# Altium schematic sheet WL-DAC.SchDoc
size 420 x 297 mm; Scale: 1:1; DocumentType: Схема электрическая принципиальная; FirstReferrence: UA3REO/R7KBI; DocumentNumber: 5; SheetNumber: 5; SheetTotal: 12
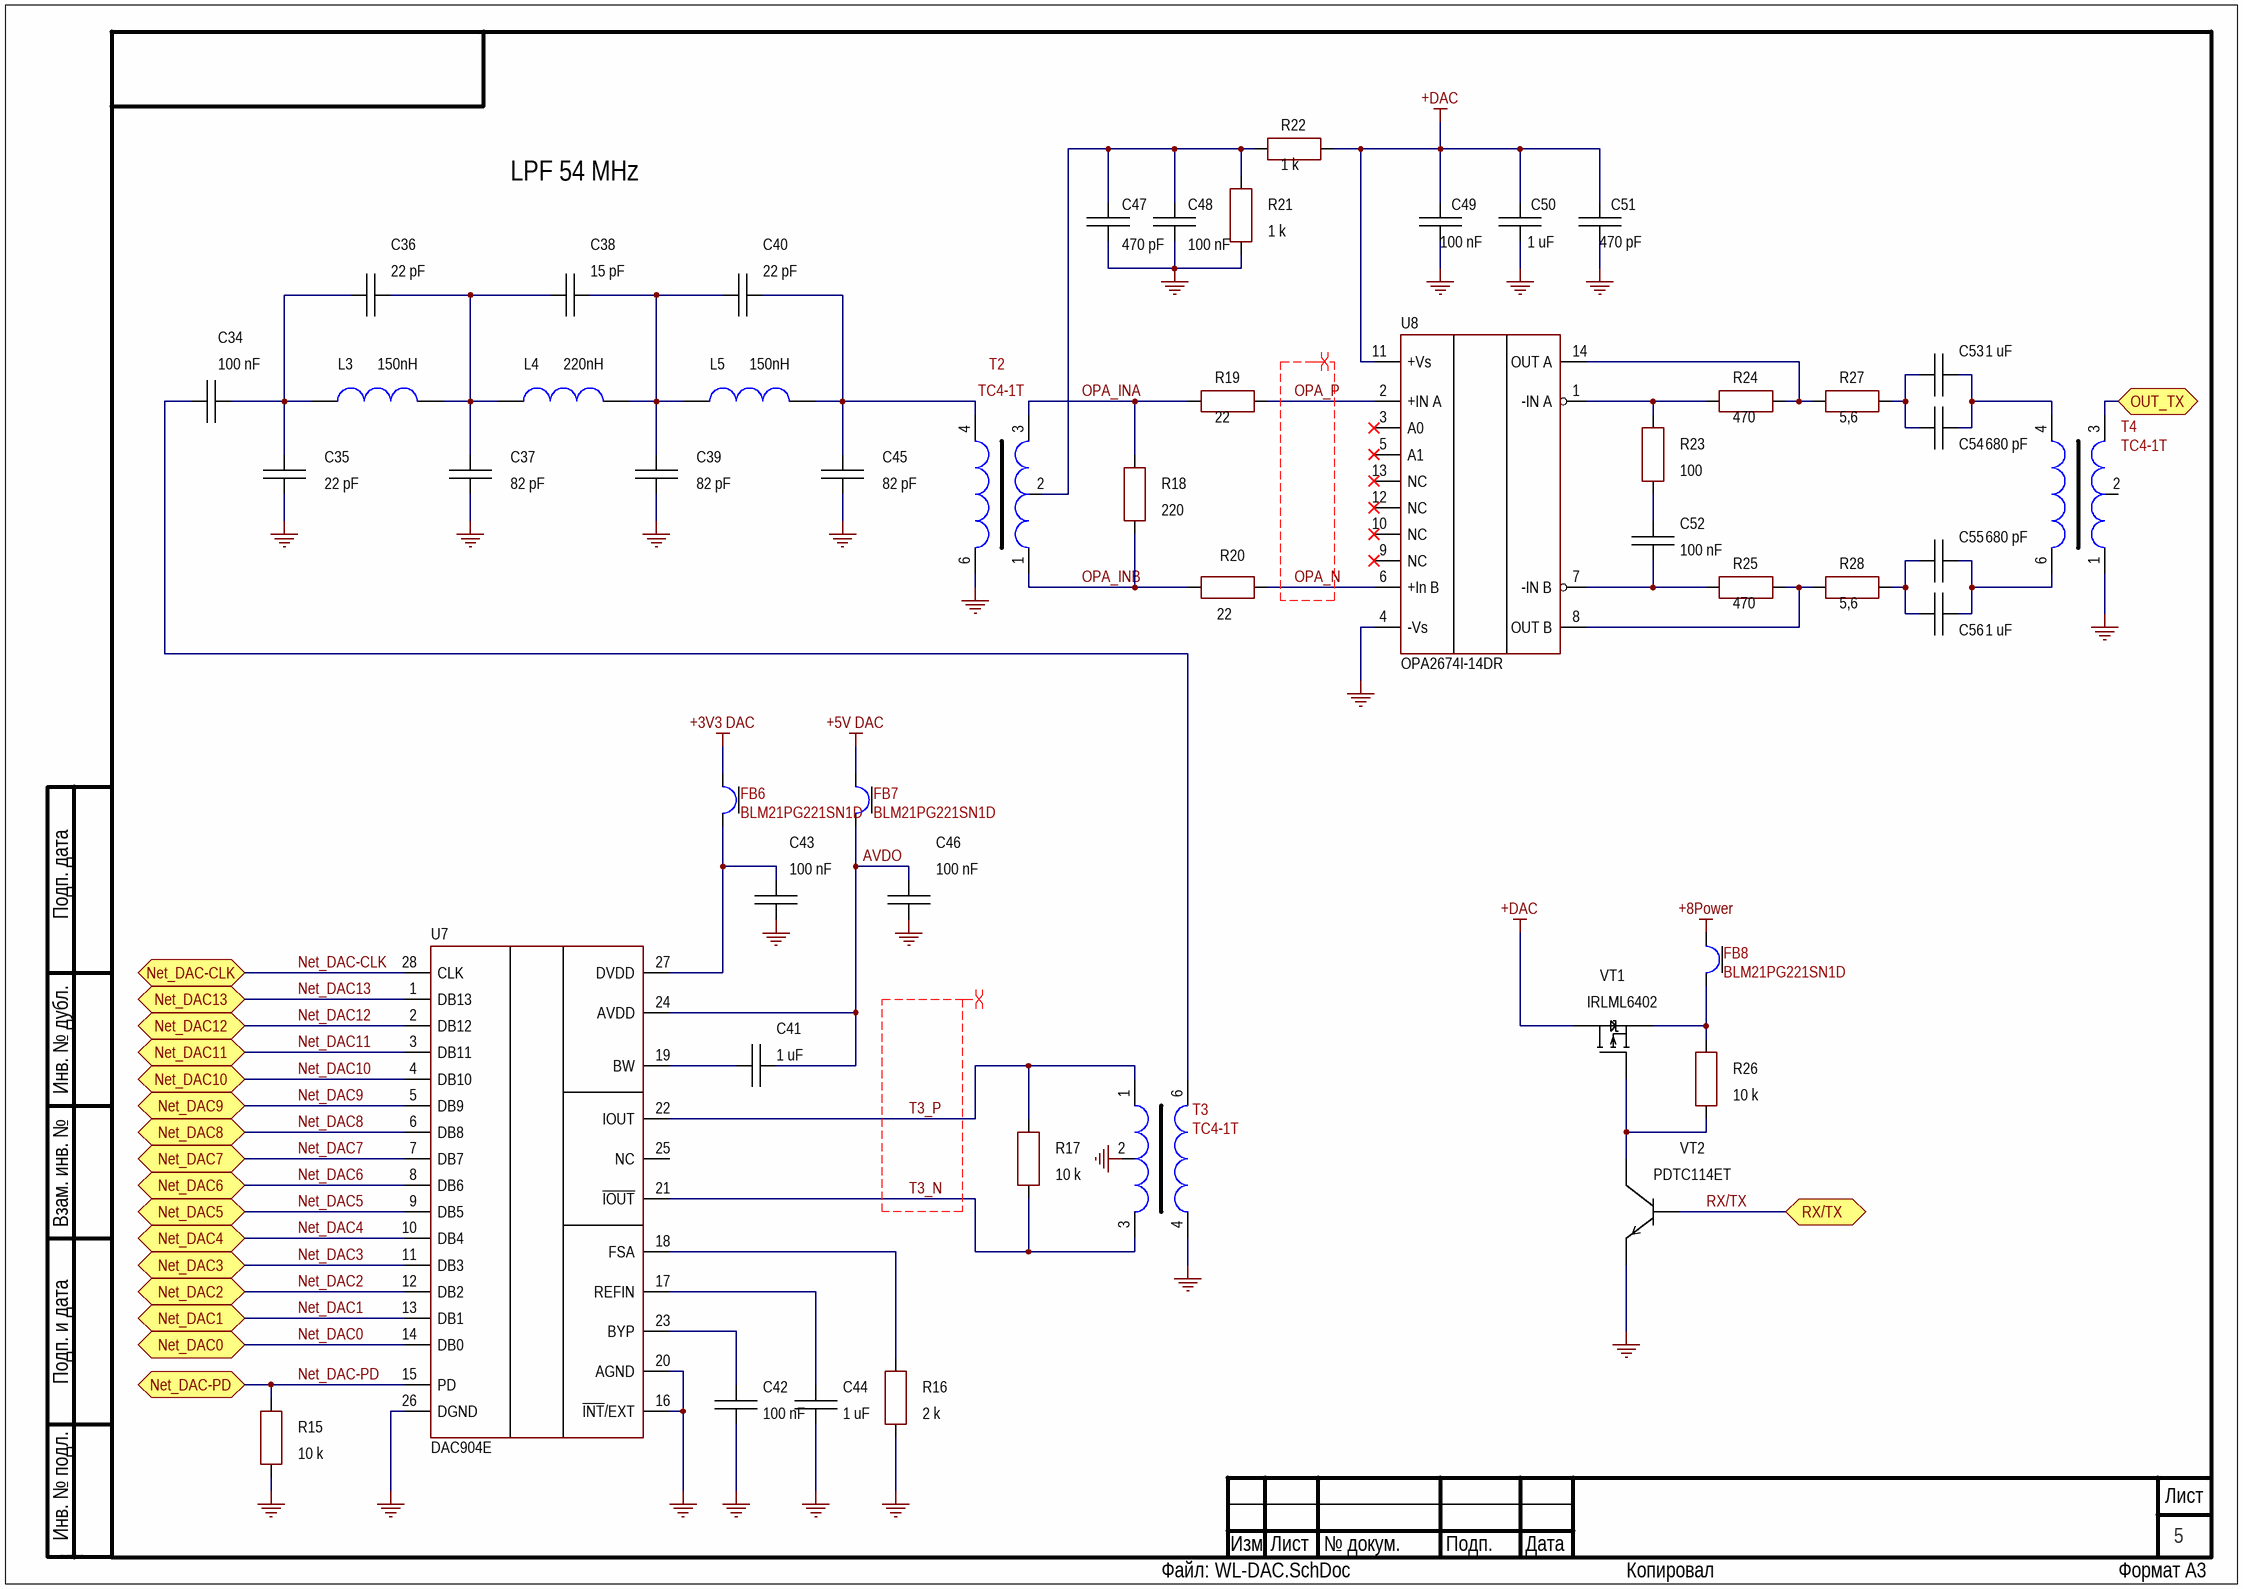
[diagram p0: WL-DAC.SchDoc]

## Parts
C34  100 nF  [C-0805-0.95]
C35  22 pF  [C-0805-0.7]
C36  22 pF  [C-0805-0.7]
C37  82 pF  [C-0805-0.7]
C38  15 pF  [C-0805-0.7]
C39  82 pF  [C-0805-0.7]
C40  22 pF  [C-0805-0.7]
C41  1 uF  [C-0805-1.25]
C42  100 nF  [C-0805-0.95]
C43  100 nF  [C-0805-0.95]
C44  1 uF  [C-0805-1.25]
C45  82 pF  [C-0805-0.7]
C46  100 nF  [C-0805-0.95]
C47  470 pF  [C-0805-0.7]
C48  100 nF  [C-0805-0.95]
C49  100 nF  [C-0805-0.95]
C50  1 uF  [C-0805-1.25]
C51  470 pF  [C-0805-0.7]
C52  100 nF  [C-0805-0.95]
C53  1 uF  [C-0805-1.25]
C54  680 pF  [C-0805-0.7]
C55  680 pF  [C-0805-0.7]
C56  1 uF  [C-0805-1.25]
FB6  BLM21PG221SN1D  [L-0805]
FB7  BLM21PG221SN1D  [L-0805]
FB8  BLM21PG221SN1D  [L-0805]
L3  150nH  [L-1210]
L4  220nH  [L-1210]
L5  150nH  [L-1210]
R15  10 k  [R-0805]
R16  2 k  [R-0805]
R17  10 k  [R-0805]
R18  220  [R-0805]
R19  22  [R-0805]
R20  22  [R-0805]
R21  1 k  [R-0805]
R22  1 k  [R-0805]
R23  100  [R-0805]
R24  470  [R-0805]
R25  470  [R-0805]
R26  10 k  [R-0805]
R27  5,6  [R-0805]
R28  5,6  [R-0805]
T2  TC4-1T  [TC4-1T]
T3  TC4-1T  [TC4-1T]
T4  TC4-1T  [TC4-1T]
U7  DAC904E  [TSSOP-28]
U8  OPA2674I-14DR  [SOIC-14]
VT1  IRLML6402  [SOT-23]
VT2  PDTC114ET  [SOT-23]

## Ports
Net_DAC0 (bidir), Net_DAC1 (bidir), Net_DAC2 (bidir), Net_DAC3 (bidir), Net_DAC4 (bidir), Net_DAC5 (bidir), Net_DAC6 (bidir), Net_DAC7 (bidir), Net_DAC8 (bidir), Net_DAC9 (bidir), Net_DAC10 (bidir), Net_DAC11 (bidir), Net_DAC12 (bidir), Net_DAC13 (bidir), Net_DAC-CLK (bidir), Net_DAC-PD (bidir), OUT_TX (bidir), RX/TX (bidir)

## Nets
+3V3 DAC: FB6.2
+5V DAC: FB7.2
+8Power: FB8.2
+DAC: C49.1 C50.1 C51.1 R22.1 U8.11(+Vs) VT1.3(D)
GND: C35.1 C37.1 C39.1 C42.2 C43.2 C44.2 C45.1 C46.2 C47.1 C48.1 C49.2 C50.2 C51.2 R15.1 R16.1 R21.2 T2.6 T3.2 T3.4 T4.1 U7.16(~{INT}/EXT) U7.20(AGND) U7.26(DGND) U8.4(-Vs) VT2.2
AVDO: C41.2 C46.1 FB7.1 U7.24(AVDD)
Net_DAC0: U7.14(DB0) ; port Net_DAC0
Net_DAC1: U7.13(DB1) ; port Net_DAC1
Net_DAC2: U7.12(DB2) ; port Net_DAC2
Net_DAC3: U7.11(DB3) ; port Net_DAC3
Net_DAC4: U7.10(DB4) ; port Net_DAC4
Net_DAC5: U7.9(DB5) ; port Net_DAC5
Net_DAC6: U7.8(DB6) ; port Net_DAC6
Net_DAC7: U7.7(DB7) ; port Net_DAC7
Net_DAC8: U7.6(DB8) ; port Net_DAC8
Net_DAC9: U7.5(DB9) ; port Net_DAC9
Net_DAC10: U7.4(DB10) ; port Net_DAC10
Net_DAC11: U7.3(DB11) ; port Net_DAC11
Net_DAC12: U7.2(DB12) ; port Net_DAC12
Net_DAC13: U7.1(DB13) ; port Net_DAC13
Net_DAC-CLK: U7.28(CLK) ; port Net_DAC-CLK
Net_DAC-PD: R15.2 U7.15(PD) ; port Net_DAC-PD
OPA_INA: R18.1 R19.1 T2.3
OPA_INB: R18.2 R20.1 T2.1
OPA_N: R20.2 U8.6(+In_B)
OPA_P: R19.2 U8.2(+IN_A)
OUT_TX: T4.3 ; port OUT_TX
RX/TX: VT2.1 ; port RX/TX
T3_N: R17.2 T3.3 U7.21(~{IOUT})
T3_P: R17.1 T3.1 U7.22(IOUT)
NetC34_1: C34.1 T3.6
NetC34_2: C34.2 C35.2 C36.1 L3.1
NetC36_2: C36.2 C37.2 C38.1 L3.2 L4.1
NetC38_2: C38.2 C39.2 C40.1 L4.2 L5.1
NetC40_2: C40.2 C45.2 L5.2 T2.4
NetC41_1: C41.1 U7.19(BW)
NetC42_1: C42.1 U7.23(BYP)
NetC43_1: C43.1 FB6.1 U7.27(DVDD)
NetC44_1: C44.1 U7.17(REFIN)
NetC47_2: C47.2 C48.2 R21.1 R22.2 T2.2
NetC52_1: C52.1 R23.1
NetC52_2: C52.2 R25.1 U8.7(-IN_B)
NetC53_1: C53.1 C54.1 R27.2
NetC53_2: C53.2 C54.2 T4.4
NetC55_1: C55.1 C56.1 R28.2
NetC55_2: C55.2 C56.2 T4.6
NetFB8_1: FB8.1 R26.2 VT1.2(S)
NetR16_2: R16.2 U7.18(FSA)
NetR23_2: R23.2 R24.1 U8.1(-IN_A)
NetR24_2: R24.2 R27.1 U8.14(OUT_A)
NetR25_2: R25.2 R28.1 U8.8(OUT_B)
NetR26_1: R26.1 VT1.1(G) VT2.3

Not connected (* = marked no-connect by the designer): T4 2; U7 25(NC); U8 3(A0)* 5(A1)* 9(NC)* 10(NC)* 12(NC)* 13(NC)*

## Layout directives
differential pair: OPA_N, OPA_P, T3_N, T3_P

## Notes on the sheet
- LPF 54 MHz
- Подп. дата
- Инв. № дубл.
- Взам. инв. №
- Подп. и дата
- Инв. № подл.
- Изм.
- Лист
- № докум.
- Подп.
- Дата
- ALTIUM GOSTBOM2.0 KEV
- Файл:
- Копировал
- Формат А3

## Library data of the parts
C34 C42 C43 C46 C48 C49 C52 = CC0805KRX7R9BB104: Manufacturer: Yageo; Value: 100; Type: Конденсатор; Dielectric: X7R; Tolerance: ±10%; Voltage: 50 V; CommentDOC: ( CC - 0805 - X7R - 50 V - 100 nF ±10% ); Part Number: CC0805KRX7R9BB104; Units: nF; Case: 0805; Operating Temperature: -55 ... 125 °C; Series: CC; Value+Units: 100 nF; ValueSCH: 100 nF; ( Series - Case - Dielectric -  Voltage - Value+Units Tolerance: ( CC - 0805 - X7R - 50 V - 100 nF ±10% )
C35 C36 C40 = CC0805JRNPO9BN220: Manufacturer: Yageo; Value: 22; Type: Конденсатор; Dielectric: NPO; Tolerance: ±5%; Voltage: 50 V; CommentDOC: ( CC - 0805 - NPO - 50 V - 22 pF ±5% ); Part Number: CC0805JRNPO9BN220; Units: pF; Case: 0805; Operating Temperature: -55 ... 125 °C; Series: CC; Value+Units: 22 pF; ValueSCH: 22 pF; ( Series - Case - Dielectric -  Voltage - Value+Units Tolerance: ( CC - 0805 - NPO - 50 V - 22 pF ±5% )
C37 C39 C45 = CC0805JRNPO9BN820: Manufacturer: Yageo; Value: 82; Type: Конденсатор; Dielectric: NPO; Tolerance: ±5%; Voltage: 50 V; CommentDOC: ( CC - 0805 - NPO - 50 V - 82 pF ±5% ); Part Number: CC0805JRNPO9BN820; Units: pF; Case: 0805; Operating Temperature: -55 ... 125 °C; Series: CC; Value+Units: 82 pF; ValueSCH: 82 pF; ( Series - Case - Dielectric -  Voltage - Value+Units Tolerance: ( CC - 0805 - NPO - 50 V - 82 pF ±5% )
C38 = CC0805JRNPO9BN150: Manufacturer: Yageo; Value: 15; Type: Конденсатор; Dielectric: NPO; Tolerance: ±5%; Voltage: 50 V; CommentDOC: ( CC - 0805 - NPO - 50 V - 15 pF ±5% ); Part Number: CC0805JRNPO9BN150; Units: pF; Case: 0805; Operating Temperature: -55 ... 125 °C; Series: CC; Value+Units: 15 pF; ValueSCH: 15 pF; ( Series - Case - Dielectric -  Voltage - Value+Units Tolerance: ( CC - 0805 - NPO - 50 V - 15 pF ±5% )
C41 C44 C50 C53 C56 = CC0805KKX7R9BB105: Manufacturer: Yageo; Value: 1; Type: Конденсатор; Dielectric: X7R; Tolerance: ±10%; Voltage: 50 V; CommentDOC: ( CC - 0805 - X7R - 50 V - 1 uF ±10% ); Part Number: CC0805KKX7R9BB105; Units: uF; Case: 0805; Operating Temperature: -55 ... 125 °C; Series: CC; Value+Units: 1 uF; ValueSCH: 1 uF; ( Series - Case - Dielectric -  Voltage - Value+Units Tolerance: ( CC - 0805 - X7R - 50 V - 1 uF ±10% )
C47 C51 = CC0805JRNPO9BN471: Manufacturer: Yageo; Value: 470; Type: Конденсатор; Dielectric: NPO; Tolerance: ±5%; Voltage: 50 V; CommentDOC: ( CC - 0805 - NPO - 50 V - 470 pF ±5% ); Part Number: CC0805JRNPO9BN471; Units: pF; Case: 0805; Operating Temperature: -55 ... 125 °C; Series: CC; Value+Units: 470 pF; ValueSCH: 470 pF; ( Series - Case - Dielectric -  Voltage - Value+Units Tolerance: ( CC - 0805 - NPO - 50 V - 470 pF ±5% )
C54 C55 = CC0805JRNPO9BN681: Manufacturer: Yageo; Value: 680; Type: Конденсатор; Dielectric: NPO; Tolerance: ±5%; Voltage: 50 V; CommentDOC: ( CC - 0805 - NPO - 50 V - 680 pF ±5% ); Part Number: CC0805JRNPO9BN681; Units: pF; Case: 0805; Operating Temperature: -55 ... 125 °C; Series: CC; Value+Units: 680 pF; ValueSCH: 680 pF; ( Series - Case - Dielectric -  Voltage - Value+Units Tolerance: ( CC - 0805 - NPO - 50 V - 680 pF ±5% )
FB6-FB8 = BLM21PG221SN1D: Manufacturer: Murata Electronics; Type: Ферритовая бусина; Part Number: BLM21PG221SN1D; Series: EMIFIL; Case: 0805; ValueSCH: BLM21PG221SN1D; Operating Temperature: −55°C ... 125°C
L3 L5 = FHW1210HCR15JGT: Manufacturer: FH(Guangdong Fenghua Advanced Tech); Type: Дроссель; Part Number: FHW1210HCR15JGT; Series: FHW; Case: 1210; ValueSCH: 150nH
L4 = FHW1210HCR22JGT: Manufacturer: FH(Guangdong Fenghua Advanced Tech); Type: Дроссель; Part Number: FHW1210HCR22JGT; Series: FHW; Case: 1210; ValueSCH: 220nH
R15 R17 R26 = RC0805JR-0710KL: Manufacturer: Yageo; Value: 10; Power: 0,125 W; Units: kOhm; Tolerance: ±5%; Operating Voltage: 150 V; Value+Units: 10 kOhm; CommentDOC: ( RC - 0805 - 0,125 W - 10 kOhm  ±5% ); Type: Резистор; Part Number: RC0805JR-0710KL; Case: 0805; Operating Temperature: -55°C ... 155°C; ValueSCH: 10 k; Series: RC
R16 = RC0805JR-072KL: Manufacturer: Yageo; Value: 2; Power: 0,125 W; Units: kOhm; Tolerance: ±5%; Operating Voltage: 150 V; Value+Units: 2 kOhm; CommentDOC: ( RC - 0805 - 0,125 W - 2 kOhm  ±5% ); Type: Резистор; Part Number: RC0805JR-072KL; Case: 0805; Operating Temperature: -55°C ... 155°C; ValueSCH: 2 k; Series: RC
R18 = RC0805JR-07220RL: Manufacturer: Yageo; Power: 0,125 W; Units: Ohm; Tolerance: ±5%; Operating Voltage: 150 V; Value+Units: 220 Ohm; CommentDOC: ( RC - 0805 - 0,125 W - 220 Ohm  ±5% ); Value: 220; Type: Резистор; Part Number: RC0805JR-07220RL; Case: 0805; Operating Temperature: -55°C ... 155°C; ValueSCH: 220; Series: RC
R19 R20 = RC0805JR-0722RL: Manufacturer: Yageo; Power: 0,125 W; Units: Ohm; Tolerance: ±5%; Operating Voltage: 150 V; Value+Units: 22 Ohm; CommentDOC: ( RC - 0805 - 0,125 W - 22 Ohm  ±5% ); Value: 22; Type: Резистор; Part Number: RC0805JR-0722RL; Case: 0805; Operating Temperature: -55°C ... 155°C; ValueSCH: 22; Series: RC
R21 R22 = RC0805JR-071KL: Manufacturer: Yageo; Value: 1; Power: 0,125 W; Units: kOhm; Tolerance: ±5%; Operating Voltage: 150 V; Value+Units: 1 kOhm; CommentDOC: ( RC - 0805 - 0,125 W - 1 kOhm  ±5% ); Type: Резистор; Part Number: RC0805JR-071KL; Case: 0805; Operating Temperature: -55°C ... 155°C; ValueSCH: 1 k; Series: RC
R23 = RC0805JR-07100RL: Manufacturer: Yageo; Power: 0,125 W; Units: Ohm; Tolerance: ±5%; Operating Voltage: 150 V; Value+Units: 100 Ohm; CommentDOC: ( RC - 0805 - 0,125 W - 100 Ohm  ±5% ); Value: 100; Type: Резистор; Part Number: RC0805JR-07100RL; Case: 0805; Operating Temperature: -55°C ... 155°C; ValueSCH: 100; Series: RC
R24 R25 = RC0805JR-07470RL: Manufacturer: Yageo; Power: 0,125 W; Units: Ohm; Tolerance: ±5%; Operating Voltage: 150 V; Value+Units: 470 Ohm; CommentDOC: ( RC - 0805 - 0,125 W - 470 Ohm  ±5% ); Value: 470; Type: Резистор; Part Number: RC0805JR-07470RL; Case: 0805; Operating Temperature: -55°C ... 155°C; ValueSCH: 470; Series: RC
R27 R28 = RC0805JR-075R6L: Manufacturer: Yageo; Power: 0,125 W; Units: Ohm; Tolerance: ±5%; Operating Voltage: 150 V; Value+Units: 5,6 Ohm; CommentDOC: ( RC - 0805 - 0,125 W - 5,6 Ohm  ±5% ); Value: 5,6; Type: Резистор; Part Number: RC0805JR-075R6L; Case: 0805; Operating Temperature: -55°C ... 155°C; ValueSCH: 5,6; Series: RC
T2-T4 = TC4-1T: Manufacturer: Mini-Circuits; Type: Трансформатор; Part Number: TC4-1T; Case: AT224-1A; Operating Temperature: −20°C ... 85°C
U7 = DAC904E: IC DAC 14BIT; Manufacturer: Texas Instruments; Voltage  Supply A/D: 2,7 V … 5,5 V; Part Number: DAC904E; Function: IC DAC 14BIT; Case: TSSOP-28; Operating Temperature: -40°C …  85°C; Type: Микросхема
U8 = OPA2674I-14DR: IC OPAMP CFA 2 CIRCUIT; Manufacturer: Texas Instruments; Voltage  Supply: +5 V...12 V / '+2,5 V...±6 V; Part Number: OPA2674I-14DR; Case: SOIC-14; Operating Temperature: −40°C … 85°C; Type: Микросхема
VT1 = IRLML6402TRPBF: Manufacturer: Infineon Technologies; Type: Транзистор; D-S Voltage max: 20 V; Drain Current max: 3,7 A; Total Power Dissipation: 1,3 W; Rds On (Max): 65 mOhm; Vgs (Max): ±12 V; Gate Threshold Voltage: 1,2 V; Input Capacitance: 633 pF; Part Number: IRLML6402TRPBF; ValueSCH: IRLML6402; Operating Temperature: -55°C ... 150°C
VT2 = PDTC114ET,215: Manufacturer: Nexperia USA Inc.; Type: Транзистор; Total Power Dissipation: 250 mW; Uce max: 50 V; Ice max: 100 mA; F max: 230 MHz; Part Number: PDTC114ET,215; ValueSCH: PDTC114ET; Operating Temperature: -65°C …  150°C; DC Current Gain: -